# EAGLE design WattMeter-PowerSocket-Controller V1.00 (EAGLE 8.0.0)
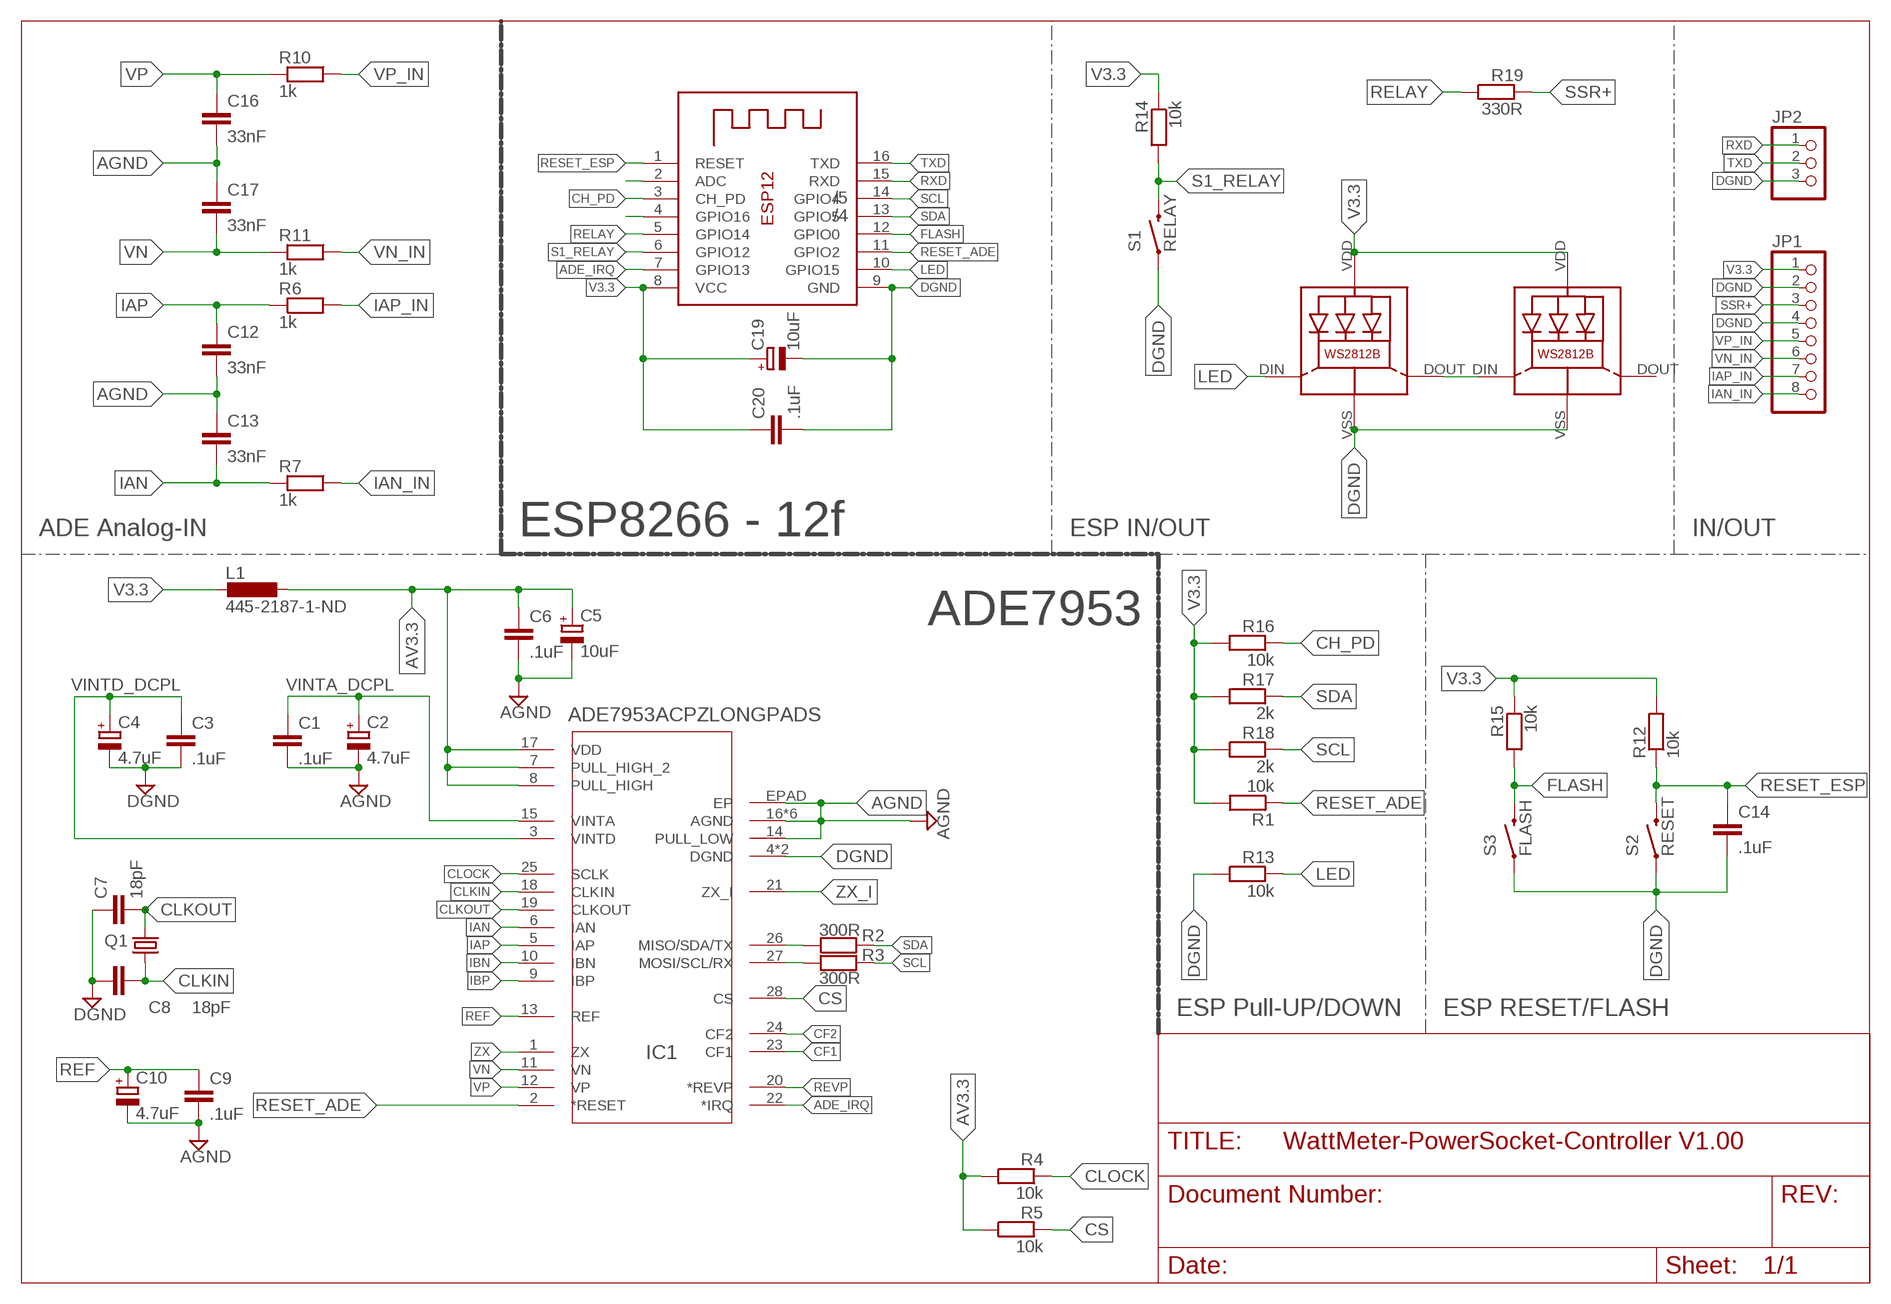
[diagram p0: schematic, sheet 1]

## Parts
C1  .1uF  C-EUC0805K  [C0805K@1]
C2  4.7uF  CPOL-EUA/3216-18R  [A/3216-18R]
C3  .1uF  C-EUC0805K  [C0805K@1]
C4  4.7uF  CPOL-EUA/3216-18R  [A/3216-18R]
C5  10uF  CPOL-EUA/3216-18R  [A/3216-18R]
C6  .1uF  C-EUC0805K  [C0805K@1]
C7  18pF  C-EUC0805K  [C0805K@1]
C8  18pF  C-EUC0805K  [C0805K@1]
C9  .1uF  C-EUC0805K  [C0805K@1]
C10  4.7uF  CPOL-EUA/3216-18R  [A/3216-18R]
C12  33nF  C-EUC0805K  [C0805K@1]
C13  33nF  C-EUC0805K  [C0805K@1]
C14  .1uF  C-EUC0805K  [C0805K@1]
C16  33nF  C-EUC0805K  [C0805K@1]
C17  33nF  C-EUC0805K  [C0805K@1]
C19  10uF  CPOL-EUA/3216-18R  [A/3216-18R]
C20  .1uF  C-EUC0805K  [C0805K@1]
IC1  ADE7953ACPZLONGPADS  ADE7953ACPZ5.0  [VQFN-28-D]
JP1  PINHD-1X8  [1X08]
JP2  PINHD-1X3  [1X03]
L1  445-2187-1-ND  L-EUL2012C  [L2012C]
LED1  WS2812B  [WS2812B]
LED2  WS2812B  [WS2812B]
Q1  535-10200-1-ND  CRYSTALSM49  [SM49]
R1  10k  R-US_R0805  [R0805@1]
R2  300R  R-US_R0805  [R0805@1]
R3  300R  R-US_R0805  [R0805@1]
R4  10k  R-US_R0805  [R0805@1]
R5  10k  R-US_R0805  [R0805@1]
R6  1k  R-US_R0805  [R0805@1]
R7  1k  R-US_R0805  [R0805@1]
R10  1k  R-US_R0805  [R0805@1]
R11  1k  R-US_R0805  [R0805@1]
R12  10k  R-US_R0805  [R0805@1]
R13  10k  R-US_R0805  [R0805@1]
R14  10k  R-US_R0805  [R0805@1]
R15  10k  R-US_R0805  [R0805@1]
R16  10k  R-US_R0805  [R0805@1]
R17  2k  R-US_R0805  [R0805@1]
R18  2k  R-US_R0805  [R0805@1]
R19  330R  R-US_R0805  [R0805@1]
S1  RELAY  SWITCH-MOMENTARY-2SMD  [TACTILE-SWITCH-SMD]
S2  RESET  SWITCH-MOMENTARY-2SMD-1101NE  [TACTILE-SWITCH-1101NE]
S3  FLASH  SWITCH-MOMENTARY-2SMD-1101NE  [TACTILE-SWITCH-1101NE]
X1  ESP-12  [ESP-12]

## Nets
ADC: X1.2(ADC)
ADE_IRQ: IC1.22(*IRQ) X1.7(GPIO13)
AGND: C1.2 C2.- C5.- C6.2 C9.2 C10.- C12.2 C13.1 C16.2 C17.1 IC1.14(PULL_LOW) IC1.16(AGND) IC1.29(AGND) IC1.30(AGND) IC1.31(AGND) IC1.32(AGND) IC1._AGND(AGND) IC1.EPAD(EP)
AV3.3 [ic]: C5.+ C6.1 IC1.7(PULL_HIGH_2) IC1.8(PULL_HIGH) IC1.17(VDD) L1.1 R4.2 R5.2
CF1 [ic]: IC1.23(CF1)
CF2 [ic]: IC1.24(CF2)
CH_PD: R16.1 X1.3(CH_PD)
CLKIN [ic]: C8.2 IC1.18(CLKIN) Q1.1
CLKOUT [ic]: C7.2 IC1.19(CLKOUT) Q1.2
CLOCK [ic]: IC1.25(SCLK) R4.1
CS [ic]: IC1.28(CS) R5.1
DGND: C3.2 C4.- C7.1 C8.1 C14.2 C19.- C20.2 IC1.4(DGND) IC1._DGND(DGND) JP1.2 JP1.4 JP2.3 LED1.VSS(GND) LED2.VSS(GND) R13.2 S1.1 S2.1 S3.1 X1.9(GND)
FLASH: R15.2 S3.2 X1.12(GPIO0)
GPIO16: X1.4(GPIO16)
IAN [ic]: C13.2 IC1.6(IAN) R7.1
IAN_IN: JP1.8 R7.2
IAP [ic]: C12.1 IC1.5(IAP) R6.1
IAP_IN: JP1.7 R6.2
IBN [ic]: IC1.10(IBN)
IBP [ic]: IC1.9(IBP)
LED: LED1.DIN(DI) R13.1 X1.10(GPIO15)
N$4: LED1.DOUT(DO) LED2.DIN(DI)
REF [ic]: C9.1 C10.+ IC1.13(REF)
RELAY: R19.2 X1.5(GPIO14)
RESET_ADE [ic]: IC1.2(*RESET) R1.1 X1.11(GPIO2)
RESET_ESP: C14.1 R12.1 S2.2 X1.1(RESET)
REVP [ic]: IC1.20(*REVP)
RXD: JP2.1 X1.15(RXD)
S1_RELAY: R14.2 S1.3 X1.6(GPIO12)
SCL: R3.2 R18.1 X1.14(GPIO4)
SCL_ [ic]: IC1.27(MOSI/SCL/RX) R3.1
SDA: R2.2 R17.1 X1.13(GPIO5)
SDA_ [ic]: IC1.26(MISO/SDA/TX) R2.1
SSR+: JP1.3 R19.1
TXD: JP2.2 X1.16(TXD)
V3.3: C19.+ C20.1 JP1.1 L1.2 LED1.VDD LED2.VDD R1.2 R12.2 R14.1 R15.1 R16.2 R17.2 R18.2 X1.8(VCC)
VINTA_DCPL [ic]: C1.1 C2.+ IC1.15(VINTA)
VINTD_DCPL [ic]: C3.1 C4.+ IC1.3(VINTD)
VN [ic]: C17.2 IC1.11(VN) R11.1
VN_IN: JP1.6 R11.2
VP [ic]: C16.1 IC1.12(VP) R10.1
VP_IN: JP1.5 R10.2
ZX [ic]: IC1.1(ZX)
ZX_I [ic]: IC1.21(ZX_I)
Unconnected: LED2.DOUT(DO)

## Notes on the sheet
- /5
- /4
- ADE Analog-IN | ESP8266 - 12f | ESP IN/OUT | IN/OUT
- ADE7953
- ESP Pull-UP/DOWN | ESP RESET/FLASH

## Library data of the parts
C1 C3 C6-C9 C12-C14 C16 C17 C20 = resistor:C-EU: CAPACITOR, European symbol
C2 C4 C5 C10 C19 = resistor:CPOL-EU: POLARIZED CAPACITOR, European symbol
IC1 = ade7953-2:ADE7953ACPZ
JP1 = pinhead:PINHD-1X8: PIN HEADER
JP2 = pinhead:PINHD-1X3: PIN HEADER
L1 = resistor:L-EU: INDUCTOR, European symbol
LED1 LED2 = WS2812B:WS2812B: Features and Benefits  * Intelligent reverse connect protection, the power supply reverse connection does not damage the IC. * The control circuit and the LED share the only power source. Control circuit and RGB chip are integrated in a package of 5050 components, form a complete control of pixel point.  * Built-in signal reshaping circuit, after wave reshaping to the next driver, ensure wave-form distortion not accumulate.  * Built-in electric reset circuit and power lost reset circuit.  * Each pixel of the three primary color can achieve 256 brightness display, completed 16777216 color full color display, and scan frequency not less than 400Hz/s.  * Cascading port transmission signal by single line.  * Any two point the distance more than 5m transmission signal without any increase circuit.  * When the refresh rate is 30fps, cascade number are not less than1024 points.  * Send data at speeds of 800Kbps.  *The color of the light were highly consistent, cost-effective. Applications  Full-color module, Full color soft lights a lamp strip. LED decorative lighting, Indoor/outdoor LED video irregular screen. General description WS2812B is a intelligent control LED light source that the control circuit and RGB chip are integrated in a package of 5050 components. It internal include intelligent digital port data latch and signal reshaping amplification drive circuit. Also include a precision internal oscillator and a 12V voltage programmable constant curre-nt control part, effectively ensuring the pixel point light color height consistent. The data transfer protocol use single NZR communication mode. After the pixel power-on reset, the DIN port receive data from controller, the first pixel collect initial 24bit data then sent to the internal data latch, the other data which reshaping by the internal signal reshaping amplification circuit sent to the next cascade pixel through the DO port. After transmission for each pixel,the signal to reduce 24bit. pixel adopt auto reshaping transmit technology, making the pixel cascade number is not limited the signal transmission, only depend on the speed of signal transmission. LED with low driving voltage, environmental protection and energy saving, high brightness, scattering angle is large, good consistency, low power, long life and other advantages. The control chip integrated in LED above becoming more simple circuit, small volume, convenient installation. Absolute Maximum Ratings Power supply voltage: VDD +3.5V..+5.3V Input voltage: VI -0.5V..VDD+0.5V based on WS2812 from https://github.com/adafruit/Adafruit-Eagle-Library
Q1 = crystal:CRYSTAL: CRYSTAL; OC_FARNELL: unknown; OC_NEWARK: unknown
R1-R7 R10-R19 = resistor:R-US_: RESISTOR, American symbol
S1 = SparkFun-Electromechanical:SWITCH-MOMENTARY-2: Various NO switches- pushbuttons, reed, etc; PROD_ID: SWCH-08247
S2 S3 = SparkFun-Electromechanical:SWITCH-MOMENTARY-2: Various NO switches- pushbuttons, reed, etc; PROD_ID: SWCH-00815
X1 = adafruit:ESP-12

## Net classes
0 default: width 0.203 mm, drill 0.508 mm, clearance 0.254 mm
1 HIGHVOLTAGE: width 0.254 mm, drill 0.508 mm, clearance 2.413 mm to class 0, clearance 1.27 mm
2 ic: width 0.152 mm, drill 0.305 mm, clearance 0.152 mm to class 0, clearance 2.413 mm to class 1, clearance 0.152 mm

## Board
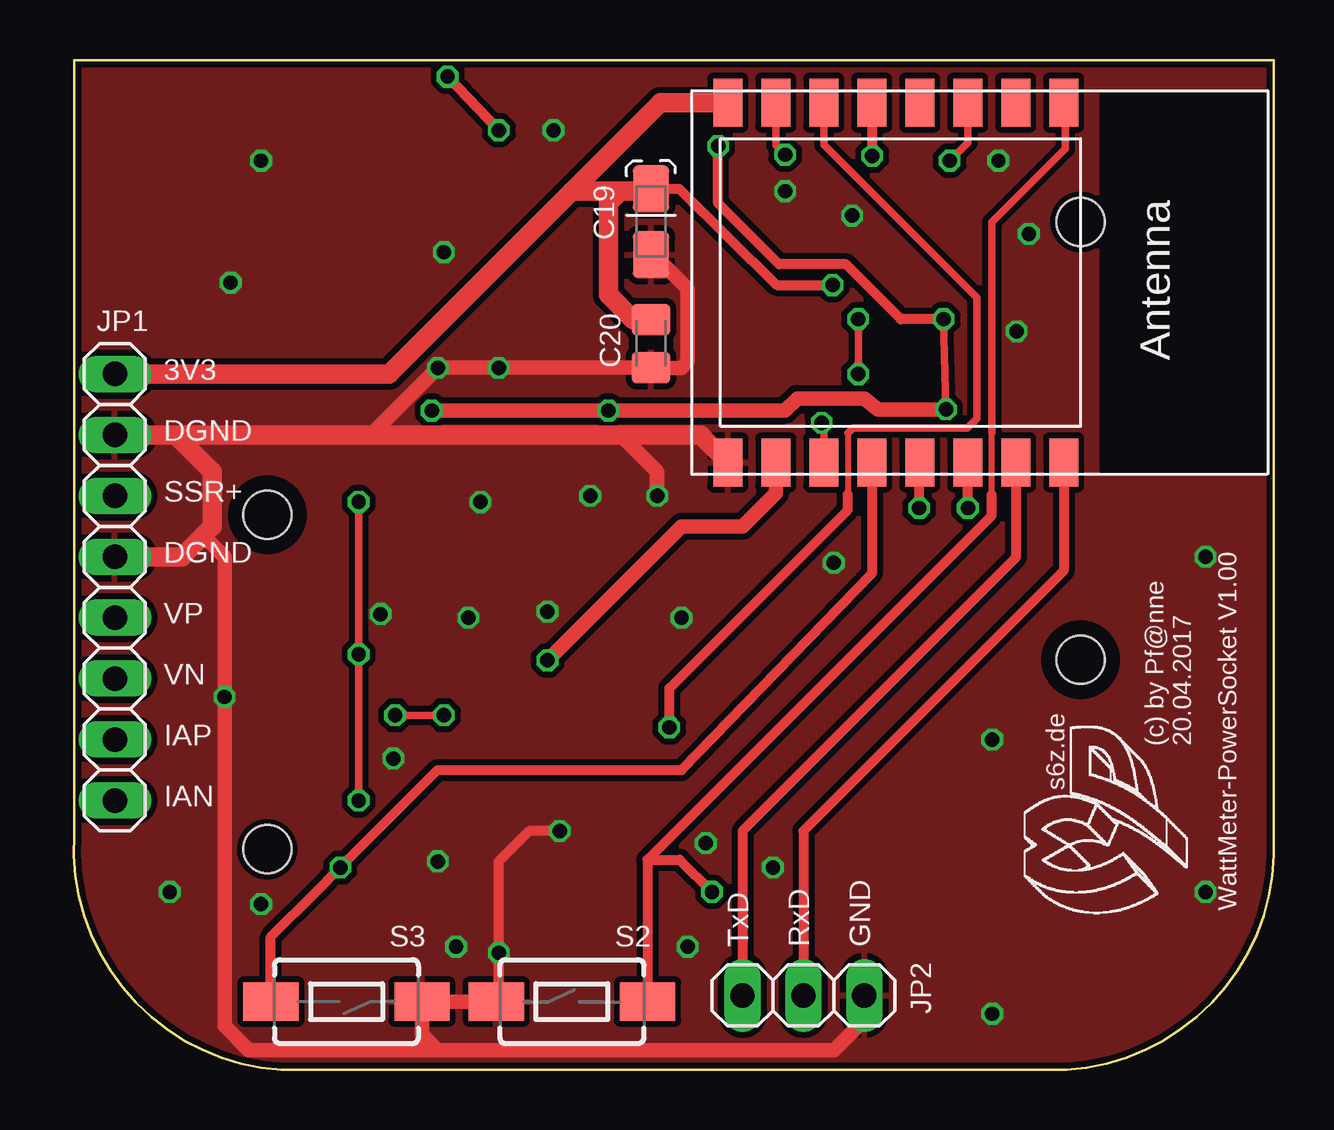
[diagram p1: board, top side]
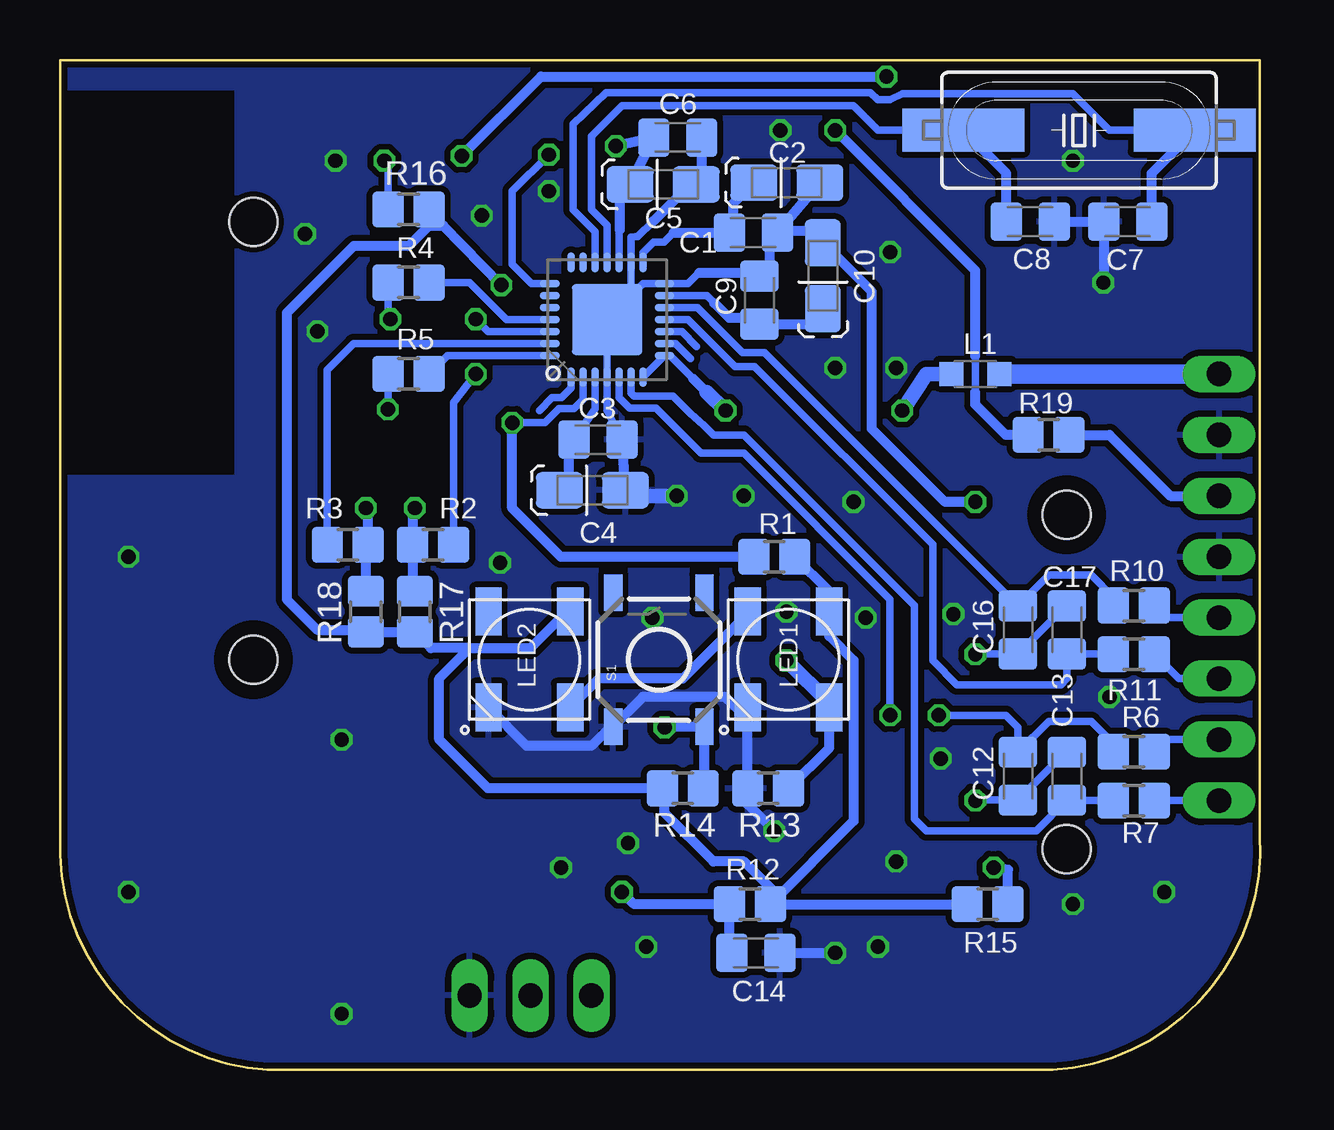
[diagram p2: board, bottom side, seen from below]

Size 50.03 x 42.1 mm. Coordinates in mm from the lower left corner, seen from the top.
Outline: 0.01,42.1 0.01,9.8 arc90 8.66,0 41.36,0 arc90 50.01,9.8 50.01,42.1 0.01,42.1
Copper layers (1*16): Top 0.035mm / dielectric 1.5mm / Bottom 0.035mm
Design rules "dirtypcbs_v1.0": minimum track width 5mil, minimum drill 12mil, track to track 5mil, track to pad 5mil, pad to pad 5mil, via to via 5mil, smd to smd 0mil, copper to edge 10mil, drill to drill 10mil, minimum pad ring 10mil, minimum via ring 6mil, stop-mask expansion 2mil, vias tented up to drill 25mil, thermal gap 10mil
Holes 2 mm at 8.06,9.2 8.06,23.15 41.96,35.35 41.96,17.1
tRestrict: area 7.1,22.2 to 9.1,24.2; area 41,16.1 to 43,18.1
bRestrict: area 7.1,22.2 to 9.1,24.2; area 41,16.1 to 43,18.1

### Footprints (pad centres in the part's own frame; a part is rotated, then mirrored left to right if it is on the bottom)
C0805K@1 = smd 1.3 x 1.6: 1 -1,0; 2 1,0
A/3216-18R = smd 1.95 x 1.5: + 1.375,0; - -1.375,0
VQFN-28-D = smd 0.813 x 0.305: 1 -2.388,1.5; 2 -2.388,1; 3 -2.388,0.5; 4 -2.388,0; 5 -2.388,-0.5; 6 -2.388,-1; 7 -2.388,-1.5; 15 2.388,-1.5; 16 2.388,-1; 17 2.388,-0.5; 18 2.388,0; 19 2.388,0.5; 20 2.388,1; 21 2.388,1.5 | smd 0.305 x 0.813: 8 -1.5,-2.388; 9 -1,-2.388; 10 -0.5,-2.388; 11 0,-2.388; 12 0.5,-2.388; 13 1,-2.388; 14 1.5,-2.388; 22 1.5,2.388; 23 1,2.388; 24 0.5,2.388; 25 0,2.388; 26 -0.5,2.388; 27 -1,2.388; 28 -1.5,2.388 | smd 1.016 x 1.016: 29 -0.762,0.762; 30 -0.762,-0.762; 31 0.762,0.762; 32 0.762,-0.762 | smd 0.762 x 0.203: _AGND 1.778,-1; _DGND -1.651,0 | smd 2.946 x 2.946: EPAD 0,0
1X08 = drill 1.016 long: 1 -8.89,0; 2 -6.35,0; 3 -3.81,0; 4 -1.27,0; 5 1.27,0; 6 3.81,0; 7 6.35,0; 8 8.89,0
1X03 = drill 1.016 long: 1 -2.54,0; 2 0,0; 3 2.54,0
L2012C = smd 1 x 1: 1 -1,0; 2 1,0
WS2812B = smd 2 x 1.1: DIN 2,1.7; DOUT -2,-1.7; VDD -2,1.7; VSS 2,-1.7
SM49 = smd 5.08 x 1.778: 1 -4.826,0; 2 4.826,0
R0805@1 = smd 1.3 x 1.5: 1 -0.85,0; 2 0.85,0
TACTILE-SWITCH-SMD = smd 1.524 x 0.762: 1 -2.794,1.905; 2 2.794,1.905; 3 -2.794,-1.905; 4 2.794,-1.905
TACTILE-SWITCH-1101NE = smd 2.3 x 1.6: 1 -3.15,0; 2 3.15,0
ESP-12 = smd 2 x 1.2: 1 -7.5,4.5; 2 -7.5,2.5; 3 -7.5,0.5; 4 -7.5,-1.5; 5 -7.5,-3.5; 6 -7.5,-5.5; 7 -7.5,-7.5; 8 -7.5,-9.5; 9 7.5,-9.5; 10 7.5,-7.5; 11 7.5,-5.5; 12 7.5,-3.5; 13 7.5,-1.5; 14 7.5,0.5; 15 7.5,2.5; 16 7.5,4.5

### Placement (x,y rotation side)
C1  21.13,34.91 0 bottom
C2  19.73,36.99 180 bottom
C3  27.6,26.27 0 bottom
C4  27.83,24.16 180 bottom
C5  24.88,36.91 180 bottom
C6  24.28,38.87 0 bottom
C7  5.52,35.36 0 bottom
C8  9.59,35.36 180 bottom
C9  20.87,32.09 90 bottom
C10  18.23,33.1 270 bottom
C12  10.09,12.25 270 bottom
C13  8.06,12.25 270 bottom
C14  21.02,4.88 0 bottom
C16  10.09,18.34 270 bottom
C17  8.06,18.34 270 bottom
C19  24.06,35.36 90 top
C20  24.06,30.28 270 top
IC1  27.22,31.27 90 bottom
JP1  1.71,20.12 270 top
JP2  30.41,3.1 0 top
L1  11.87,29.01 0 bottom
LED1  19.66,17.1 270 bottom
LED2  30.46,17.1 270 bottom
Q1  7.55,39.17 0 bottom
R1  20.25,21.39 0 bottom
R2  34.48,21.9 180 bottom
R3  38.03,21.9 0 bottom
R4  35.49,32.82 180 bottom
R5  35.49,29.01 180 bottom
R6  5.27,13.26 0 bottom
R7  5.27,11.23 0 bottom
R10  5.27,19.36 0 bottom
R11  5.27,17.33 0 bottom
R12  21.27,6.91 0 bottom
R13  20.51,11.74 180 bottom
R14  24.06,11.74 0 bottom
R15  11.36,6.91 0 bottom
R16  35.49,35.87 0 bottom
R17  35.24,19.1 270 bottom
R18  37.27,19.1 270 bottom
R19  8.82,26.47 180 bottom
S1  25.06,17.1 90 bottom
S2  20.76,2.85 0 top
S3  11.36,2.85 180 top
X1  36.76,32.82 270 top

### Tracks (layer width: path | path; a pad name or v marks a point on that pad's centre or on a via)
ADE_IRQ  (via drill 0.6)
  Top 0.305: X1.7 29.26,38.54 v29.65,38.15
  Bottom 0.305: IC1.22 30.37,32.77 31.18,33.58 31.18,36.63 v29.65,38.15
AGND  (via drill 0.6)
  Top 0.305: v11.87,11.23 v11.87,17.33 v11.87,23.68
  Bottom 0.305: 26.07,32.43 25.72,32.77 IC1.14 23.84,32.77 23.39,33.23 | 26.07,32.43 IC1.32 IC1.30 IC1.EPAD | 26.07,32.43 26.22,32.59 IC1._AGND IC1.16 26.22,34.71 26.03,34.73 25.95,34.73 25.29,35.39 | 18.1,34.35 C10.- 18.1,34.34 | C17.1 8.09,19.34 C16.2 11.86,17.34 v11.87,17.33 | C13.1 8.09,13.25 C12.2 11.86,11.25 v11.87,11.23 | IC1.EPAD IC1.31 | IC1.29 IC1.EPAD
  Bottom 0.406: 23.39,33.23 21.01,33.23 C9.2 20.44,33.52 20.44,34.98 C1.2 | C1.2 20.05,34.98 18.66,34.98 C10.- 16.19,32.44 16.19,26.72 13.14,23.68 v11.87,23.68 | C1.2 C2.- | 25.29,35.39 23.92,36.76 23.49,36.76 C5.- 23.11,36.89 23.28,37.06 C6.2
AV3.3  (via drill 0.6)
  Top 0.305: v36.36,27.54 v36.26,31.3
  Top 0.406: v36.26,31.3 34.48,31.3 32.19,33.58 29.4,33.58 26.86,36.12 v26.86,38.51
  Top 0.61: v14.92,27.49 v22.29,27.49 29.65,27.49 30.16,27.99 32.95,27.99 33.51,27.54 v36.36,27.54
  Bottom 0.305: IC1.7 IC1.8 24.6,29.78 23.64,28.81 | IC1.17 26.72,34.97 26.69,35.01 | C6.1 25.28,39.24 | R5.2 36.34,27.57 v36.36,27.54 | R4.2 36.34,31.38 v36.26,31.3
  Bottom 0.406: 26.69,35.01 26.69,36.22 C5.+ C6.1 v26.86,38.51 | 23.08,28.25 23.64,28.81
  Bottom 0.61: v22.29,27.49 23.08,28.25 | L1.1 13.9,29.01 v14.92,27.49
CH_PD  (via drill 0.6)
  Top 0.305: X1.3 37.26,38.65 v36.51,37.9
  Bottom 0.305: R16.1 36.34,37.73 v36.51,37.9
CLKIN
  Bottom 0.305: IC1.18 27.22,35.22 27.87,35.87 27.87,38.92 26.6,40.19 16.95,40.19 15.94,39.17 Q1.1
  Bottom 0.406: C8.2 10.59,37.38 Q1.1
CLKOUT
  Bottom 0.305: Q1.2 6.28,39.17 7.81,40.69 14.92,40.69 15.43,40.44 15.94,40.44 16.24,40.74 27.26,40.74 28.64,39.42 28.64,35.87 27.72,34.95 IC1.19
  Bottom 0.406: C7.2 4.52,37.38 Q1.2
CLOCK
  Bottom 0.305: IC1.25 31.41,31.28 32.95,32.82 R4.1
CS
  Bottom 0.305: IC1.28 33.88,29.78 R5.1
DGND  (via drill 0.6)
  Top 0.406: v20.25,9.96 18.98,9.96 17.71,8.69 v17.71,4.88 17.71,2.95 S2.1
  Top 0.61: S2.1 S3.1 14.51,1.48 15.17,0.82 | JP2.3 32.7,1.83 31.68,0.82 15.17,0.82 | 24.17,34.09 C19.- 24.17,33.98 25.59,32.57 25.59,29.52 25.33,29.26 24.08,29.26 C20.2 15.19,29.28 12.38,26.47 | 5.39,22.28 6.28,21.39 6.28,1.83 7.3,0.82 15.17,0.82 | v24.32,23.93 24.32,24.95 22.79,26.47
  Top 0.813: X1.9 26.11,26.47 22.79,26.47 12.38,26.47 JP1.2 4.25,26.47 5.78,24.95 5.78,22.66 5.39,22.28 4.51,21.39 JP1.4
  Bottom 0.305: C3.2 27.22,27.49 IC1.4 IC1._DGND 27.22,30.64
  Bottom 0.406: 26.54,26.2 C3.2 C4.- | C8.1 C7.1 6.52,32.84 v6.54,32.82 | LED2.VSS 30.58,13.52 27.87,13.52 27.08,14.31 S1.1 25.73,15.55 22.29,15.55 21.84,15.1 LED1.VSS R13.2 21.36,11.06 v20.25,9.96 | C14.2 v17.71,4.88
  Bottom 0.61: v24.32,23.93 26.22,23.93 C4.-
  other vias: 15.43,34.09 7.81,37.9 4,7.42 38.29,2.34 38.29,13.77 47.18,21.39 47.18,7.42 25.33,18.85 21.52,23.93 16.95,23.68 16.44,18.85 19.75,19.1 15.17,8.69 7.81,6.91 15.94,5.13 25.59,5.13 29.14,8.44 31.68,21.14 39.3,30.79 39.81,34.85 38.54,37.9 26.35,9.45 32.45,35.61 29.65,36.63 15.17,29.26 20,39.17 17.71,29.26 6.28,15.55 12.79,19 13.32,12.98
  pour Bottom: -1.34,42.98 52,42.98 52,-1.47 -1.34,-1.47
  pour Top: -1.34,42.98 50.73,42.98 50.73,-1.47 -1.34,-1.47
FLASH  (via drill 0.6)
  Top 0.406: S3.2 8.21,5.54 10.09,7.42 | 10.6,7.93 10.09,7.42 | X1.12 33.26,20.68 25.33,12.5 15.17,12.5 v11.11,8.44 10.09,7.42
  Bottom 0.406: R15.2 10.51,8.35 v11.11,8.44
IAN
  Bottom 0.305: IC1.6 26.22,28.22 26.1,28.1 24.48,28.1 23.74,27.36 23.18,26.86 22.79,26.47 21.52,26.47 14.41,19.36 14.41,10.47 13.9,9.96 9.33,9.96 C13.2 8.05,11.23 R7.1
IAN_IN
  Bottom 0.305: JP1.8 R7.2
IAP  (via drill 0.6)
  Top 0.305: v13.4,14.79 v15.43,14.79
  Bottom 0.305: IC1.5 26.72,28.03 26.28,27.59 25.19,27.59 23.3,25.71 21.52,25.71 15.43,19.61 v15.43,14.79 | R6.1 6.12,13.6 7.05,14.53 8.81,14.53 C12.1 10.09,14.28 10.6,14.79 v13.4,14.79
IAP_IN
  Bottom 0.305: JP1.7 3.91,13.77 R6.2
IBN
  Bottom 0.305: IC1.10 24.11,30.78 23.49,30.16
IBP
  Bottom 0.305: IC1.9 24.37,30.28 23.74,29.65
LED  (via drill 0.6)
  Top 0.61: X1.10 29.26,24.05 27.87,22.66 25.33,22.66 v19.75,17.07
  Bottom 0.406: LED1.DIN 17.96,13.43 R13.1
  Bottom 0.61: LED1.DIN 17.96,15.29 v19.75,17.07
N$4
  Bottom 0.406: LED1.DOUT 21.36,19.01 24.06,16.31 27.55,16.31 LED2.DIN
REF
  Bottom 0.305: IC1.13 23.07,32.27 22.75,31.96
  Bottom 0.406: 22.75,31.96 22.14,31.35 21.13,31.35 C9.1 18.87,31.09 C10.+
RELAY  (via drill 0.6)
  Top 0.406: X1.5 33.26,38.12 v33.28,38.1 | v17.71,39.17 v15.58,41.4
  Bottom 0.305: 11.87,28.25 11.87,29.77
  Bottom 0.406: R19.2 10.6,26.47 11.87,27.74 11.87,28.25 | 11.87,29.77 11.87,33.33 v17.71,39.17 | v33.28,38.1 29.98,41.4 v15.58,41.4
RESET_ADE  (via drill 0.6)
  Top 0.305: X1.11 31.26,26.89 v31.18,26.98
  Bottom 0.305: IC1.2 28.22,27.94 28.59,27.57 29.23,27.57 29.81,26.98 v31.17,26.98 v31.18,26.98
  Bottom 0.406: R1.1 29.14,21.39 31.18,23.42 v31.18,26.98
RESET_ESP  (via drill 0.6)
  Top 0.254: 38.26,23.98 38.26,26.55
  Top 0.305: 38.26,26.55 38.26,35.33 41.34,38.41 41.34,40.25 X1.1
  Top 0.406: 23.91,8.77 38.26,23.12 38.26,23.98 | 23.91,8.77 S2.2 | 23.91,8.77 25.26,8.77 v26.6,7.42
  Bottom 0.406: C14.1 22.12,4.98 R12.1 26.1,6.91 v26.6,7.42
RXD
  Top 0.406: X1.15 39.26,21.35 27.87,9.96 JP2.1
S1_RELAY  (via drill 0.6)
  Top 0.254: 32.27,26.55 32.27,24.01
  Top 0.305: 32.55,26.75 32.95,26.75 | 32.95,26.75 37.25,26.75 37.65,27.16 37.65,32.18 31.28,38.56 31.28,40.31 X1.6 | 32.95,26.75 32.47,26.75 32.27,26.55
  Top 0.406: v24.83,14.28 24.83,15.9 32.27,23.35 32.27,24.01
  Bottom 0.406: R14.2 23.16,11.79 S1.3 24.8,14.31
  Bottom 0.61: 24.8,14.31 v24.83,14.28
SCL  (via drill 0.6)
  Top 0.406: v37.27,23.42 X1.14
  Bottom 0.406: v37.27,23.42 37.18,23.33 R3.2 37.27,21.81 R18.1
SCL_
  Bottom 0.305: IC1.27 37.78,30.28 38.88,29.18 R3.1
SDA  (via drill 0.6)
  Top 0.406: v35.24,23.42 35.24,25.3 X1.13
  Bottom 0.406: v35.24,23.42 35.33,23.33 R2.2 35.33,20.04 R17.1
SDA_  (via drill 0.6)
  Top 0.305: v32.7,29.01 v32.7,31.3
  Bottom 0.305: IC1.26 32.18,30.78 v32.7,31.3 | R2.1 33.63,27.83 v32.7,29.01
SSR+
  Bottom 0.406: R19.1 6.28,26.47 3.74,23.93 JP1.3
TXD
  Top 0.406: X1.16 41.26,20.81 30.41,9.96 JP2.2
V3.3  (via drill 0.6)
  Top 0.406: C19.+ 25.23,36.73 29.3,32.72 v31.63,32.72
  Top 0.61: 22.79,36.63 23.96,36.63 | 24.17,36.63 C19.+ | 24.45,40.32 24.71,40.32
  Top 0.813: C20.1 23.32,31.28 22.29,32.31 22.29,36.12 22.79,36.63 | JP1.1 13.14,29.01 20.76,36.63 | 20.76,36.63 23.96,36.63 C19.+ | X1.8 24.45,40.32 20.76,36.63
  Bottom 0.406: LED2.VDD 28.89,19.1 30.41,17.58 32.95,17.58 | 32.95,17.58 34.57,17.58 R17.2 R18.2 37.36,18.34 39.3,18.34 40.57,19.61 40.57,31.55 37.78,34.34 35.49,34.34 34.64,35.19 | 32.95,17.58 34.22,16.31 34.22,13.77 32.19,11.74 R14.1 24.83,11.65 24.83,10.72 22.79,8.69 21.52,8.69 20.17,7.33 R12.2 | R12.2 R15.1 | R12.2 16.95,10.38 16.95,17.07 17.96,18.08 LED1.VDD 17.96,19.95 R1.2 | R16.2 34.64,35.19 | 34.64,35.19 34.06,35.19 v31.63,32.72
  Bottom 0.813: L1.2 JP1.1
VINTA_DCPL
  Bottom 0.305: IC1.15 25.72,34.07 25.29,34.5 24.86,34.5 24.45,34.91
  Bottom 0.406: C2.+ 21.96,36.13 21.96,34.73 C1.1 24.45,34.91
VINTD_DCPL
  Bottom 0.305: IC1.3 27.73,27.54 C3.1
  Bottom 0.406: C3.1 28.82,26.09 28.82,24.17 C4.+
VN
  Bottom 0.305: IC1.11 23.84,31.28 21.89,29.32 21.07,29.32 13.65,21.9 13.65,17.07 12.63,16.06 8.32,16.06 8.06,16.31 8.06,16.83 7.55,17.34 | 7.55,17.34 C17.2 | 7.55,17.34 6.13,17.34 R11.1
VN_IN
  Bottom 0.305: JP1.6 3.4,16.31 R11.2
VP
  Bottom 0.305: IC1.12 23.45,31.78 21.58,29.9 20.65,29.9 C16.1 8.81,20.63 7.05,20.63 6.12,19.7 R10.1 6.12,19.95
VP_IN
  Bottom 0.305: JP1.5 3.91,18.85 R10.2
ZX
  Bottom 0.305: 30.04,27.49 29.51,28.02 29.13,28.02 28.72,28.43 IC1.1

### Text on the board
tNames: 3V3 | DGND | SSR+ | DGND | VP | VN | IAP | (c) by Pf@nne / 20.04.2017 | s6z.de | IAN | WattMeter-PowerSocket V1.00 | TxD | RxD | GND